# Altium schematic sheet Power.SchDoc
size A4
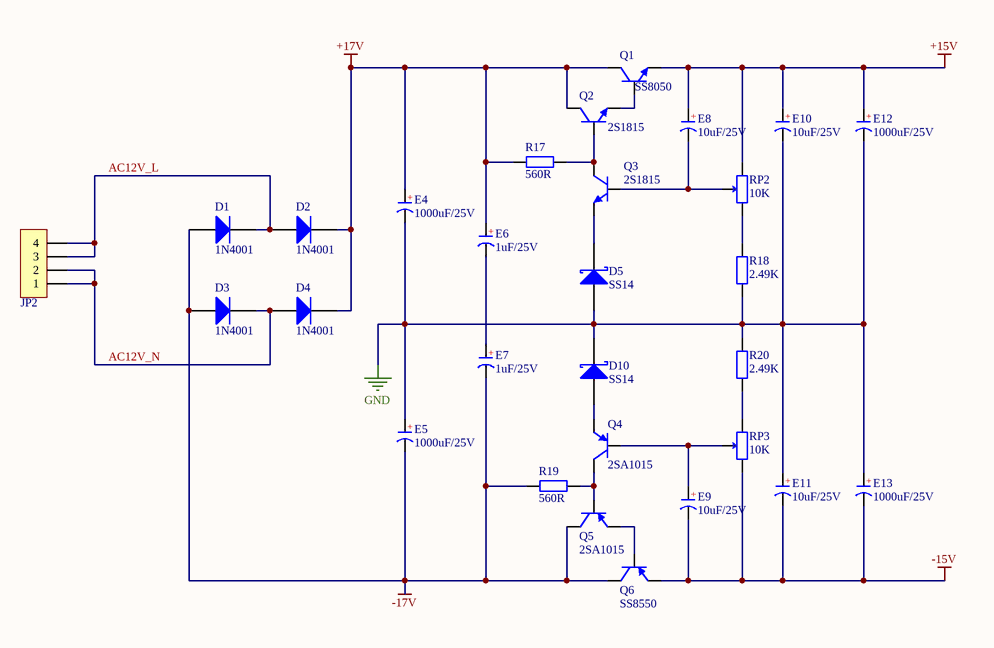
[diagram p0: Power.SchDoc]

## Parts
D1  Type: 1N4001  [DIODE-SMA]  (hidden comment: Diode)
D2  Type: 1N4001  [DIODE-SMA]  (hidden comment: Diode)
D3  Type: 1N4001  [DIODE-SMA]  (hidden comment: Diode)
D4  Type: 1N4001  [DIODE-SMA]  (hidden comment: Diode)
D5  SS14  [SMA]
D10  SS14  [SMA]
E4  1000uF/25V  [CM G(12.5*13.5)]
E5  1000uF/25V  [CM G(12.5*13.5)]
E6  1uF/25V  [CD A(3216)]
E7  1uF/25V  [CD A(3216)]
E8  10uF/25V  [CM A(3*5.4)]
E9  10uF/25V  [CM A(3*5.4)]
E10  10uF/25V  [CD A(3216)]
E11  10uF/25V  [CD A(3216)]
E12  1000uF/25V  [CM G(12.5*13.5)]
E13  1000uF/25V  [CM G(12.5*13.5)]
JP2  HDR-1X4  [PH2.0-WS-4P]  (value not drawn)
Q1  SS8050  [SOT23-3N]
Q2  2S1815  [SOT23-3N]
Q3  2S1815  [SOT23-3N]
Q4  2SA1015  [SOT23-3N]
Q5  2SA1015  [SOT23-3N]
Q6  SS8550  [SOT23-3N]
R17  560R  [R 0603_L]
R18  2.49K  [R 0603_L]
R19  560R  [R 0603_L]
R20  2.49K  [R 0603_L]
RP2  10K  [3296W]
RP3  10K  [3296W]

## Nets
+15V: E8.1(A) E10.1(A) E12.1(A) Q1.2(E) RP2.1
+17V: D2.2(K) D4.2(K) E4.1(A) E6.1(A) Q1.3(C) Q2.3(C) R17.2
-15V: E9.2(K) E11.2(K) E13.2(K) Q6.2(E) RP3.3
-17V: D1.1(A) D3.1(A) E5.2(K) E7.2(K) Q5.3(C) Q6.3(C) R19.2
GND: D5.1(A) D10.2(K) E4.2(K) E5.1(A) E10.2(K) E11.1(A) E12.2(K) E13.1(A) R18.1 R20.2
NetD1_2: D1.2(K) D2.1(A) JP2.3 JP2.4
NetD3_2: D3.2(K) D4.1(A) JP2.1 JP2.2
NetD5_2: D5.2(K) Q3.2(E)
NetD10_1: D10.1(A) Q4.2(E)
NetE6_2: E6.2(K) E7.1(A)
NetE8_2: E8.2(K) Q3.1(B) RP2.2
NetE9_1: E9.1(A) Q4.1(B) RP3.2
NetQ1_1: Q1.1(B) Q2.2(E)
NetQ2_1: Q2.1(B) Q3.3(C) R17.1
NetQ4_3: Q4.3(C) Q5.1(B) R19.1
NetQ5_2: Q5.2(E) Q6.1(B)
NetR18_2: R18.2 RP2.3
NetR20_1: R20.1 RP3.1

## Notes on the sheet
- AC12V_L
- AC12V_N
- (in symbol CE_SMD) +
- (in symbol CT) +

## Library data of the parts
D1-D4 = Diode: 二极管; Published: 8-Jun-2000; LatestRevisionDate: 17-Jul-2002; LatestRevisionNote: Re-released for DXP Platform.; PackageDocument: Sep-1996; PackageReference: SMC; Publisher: Altium Limited; Code_JEDEC: DO-214-AB
D5 D10 = SS14: 肖特基二极管; 属性: 40V/1A; BOM名称: 肖特基二极管; 封装库来自淘宝 ID：黄晶宝石: https://shop463601444.taobao.com
E4 E5 E8 E9 E12 E13 = CE_SMD: 贴片电解电容; 版权归属: 封装库来自淘宝 ID：黄晶宝石; BOM名称: 贴片电解电容; 联系售后: https://shop463601444.taobao.com
E6 E7 E10 E11 = CT: 贴片钽电容; 淘宝ID: 封装库来自淘宝 ID：黄晶宝石; BOM名称: 贴片钽电容; 联系售后: https://shop463601444.taobao.com
JP2 = Header 4: 4P接插件; 封装库来自淘宝卖家 ID：黄晶宝石: 其他店铺购入均为盗版，不享受售后技术支持服务，请立即申请退款
Q1-Q3 = 8050-SMD: 高频放大-NPN型; 版权归属: 封装库来自淘宝 ID：黄晶宝石; 属性: 40V 1.5A 1W 100MHZ; BOM名称: 高频放大-NPN型; 联系售后: https://shop463601444.taobao.com
Q4-Q6 = 8550-SMD: 高频放大-PNP型; 版权归属: 封装库来自淘宝 ID：黄晶宝石; 属性: 40V 1.5A 1W 100MHZ; BOM名称: 高频放大-PNP型; 学习资源: www.ooocke.com
R17-R20 = R: 贴片电阻; 版权归属: 来自淘宝 ID：黄晶宝石; 封装库来自淘宝卖家 ID：黄晶宝石: 其他店铺购入均为盗版，不享受售后技术支持服务，请立即申请退款; BOM名称: 贴片电阻; 联系售后: https://shop463601444.taobao.com
RP2 RP3 = RP: 单联电位器; BOM名称: 插件电位器; 版权归属: 封装库来自淘宝 ID：黄晶宝石; 联系售后: https://shop463601444.taobao.com